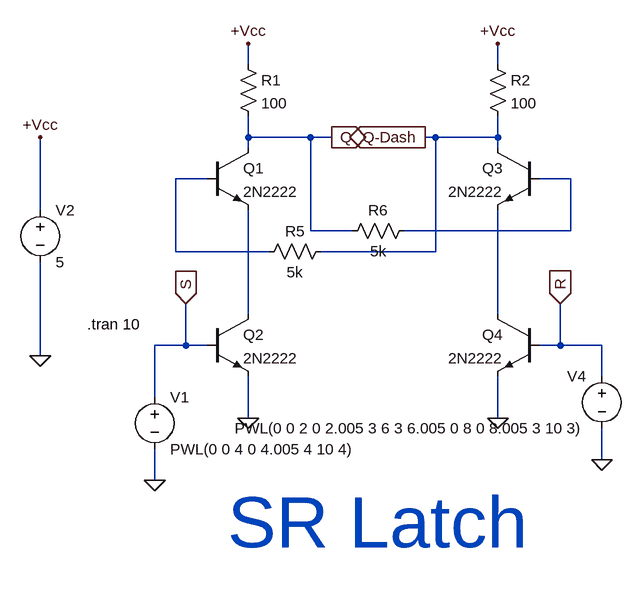
[diagram p0: schematic SR Latch.asc]
SR Latch.asc, the LTspice schematic file:
Version 4
SHEET 1 1500 1808
WIRE 80 0 80 -32
WIRE 464 0 464 -32
WIRE 80 112 80 80
WIRE 176 112 80 112
WIRE 208 112 176 112
WIRE 368 112 352 112
WIRE 464 112 464 80
WIRE 464 112 368 112
WIRE 80 128 80 112
WIRE 464 128 464 112
WIRE 16 176 -32 176
WIRE 576 176 528 176
WIRE -240 224 -240 112
WIRE 176 256 176 112
WIRE 240 256 176 256
WIRE 576 256 576 176
WIRE 576 256 320 256
WIRE -32 288 -32 176
WIRE 112 288 -32 288
WIRE 368 288 368 112
WIRE 368 288 192 288
WIRE 80 384 80 224
WIRE 464 384 464 224
WIRE -16 432 -16 368
WIRE -16 432 -64 432
WIRE 16 432 -16 432
WIRE 560 432 560 368
WIRE 560 432 528 432
WIRE 624 432 560 432
WIRE -240 448 -240 304
WIRE 624 480 624 432
WIRE -64 512 -64 432
WIRE 80 544 80 480
WIRE 464 544 464 480
WIRE 624 608 624 560
WIRE -64 640 -64 592
FLAG 80 -32 +Vcc
FLAG 464 -32 +Vcc
FLAG 208 112 Q
IOPIN 208 112 Out
FLAG 352 112 Q-Dash
IOPIN 352 112 Out
FLAG 464 544 0
FLAG 80 544 0
FLAG 560 368 R
IOPIN 560 368 In
FLAG -16 368 S
IOPIN -16 368 In
FLAG -64 640 0
FLAG 624 608 0
FLAG -240 112 +Vcc
FLAG -240 448 0
SYMBOL npn 16 128 R0
SYMATTR InstName Q1
SYMATTR Value 2N2222
SYMBOL npn 16 384 R0
SYMATTR InstName Q2
SYMATTR Value 2N2222
SYMBOL npn 528 128 M0
SYMATTR InstName Q3
SYMATTR Value 2N2222
SYMBOL npn 528 384 M0
SYMATTR InstName Q4
SYMATTR Value 2N2222
SYMBOL Res 64 -16 R0
SYMATTR InstName R1
SYMATTR Value 100
SYMBOL Res 448 -16 R0
SYMATTR InstName R2
SYMATTR Value 100
SYMBOL Res 208 272 R90
WINDOW 0 0 56 VBottom 2
WINDOW 3 32 56 VTop 2
SYMATTR InstName R5
SYMATTR Value 5k
SYMBOL Res 336 240 R90
WINDOW 0 0 56 VBottom 2
WINDOW 3 32 56 VTop 2
SYMATTR InstName R6
SYMATTR Value 5k
SYMBOL voltage -64 496 R0
SYMATTR InstName V1
SYMATTR Value PWL(0 0 4 0 4.005 4 10 4)
SYMBOL voltage 624 464 M0
SYMATTR InstName V4
SYMATTR Value PWL(0 0 2 0 2.005 3 6 3 6.005 0 8 0 8.005 3 10 3)
SYMBOL voltage -240 208 R0
SYMATTR InstName V2
SYMATTR Value 5
TEXT -168 400 Left 2 !.tran 10
TEXT 48 704 Left 7 ;SR Latch

The netlist it stands for:
* SR Latch.asc
Q1 Q N001 N003 0 2N2222
Q2 N003 S 0 0 2N2222
Q3 Q-Dash N002 N004 0 2N2222
Q4 N004 R 0 0 2N2222
R1 +Vcc Q 100
R2 +Vcc Q-Dash 100
R5 Q-Dash N001 5k
R6 N002 Q 5k
V1 S 0 PWL(0 0 4 0 4.005 4 10 4)
V4 R 0 PWL(0 0 2 0 2.005 3 6 3 6.005 0 8 0 8.005 3 10 3)
V2 +Vcc 0 5
.model NPN NPN
.model PNP PNP
.lib standard.bjt
.tran 10
* SR Latch
.backanno
.end